# Altium schematic sheet FET_M1.SchDoc
size A
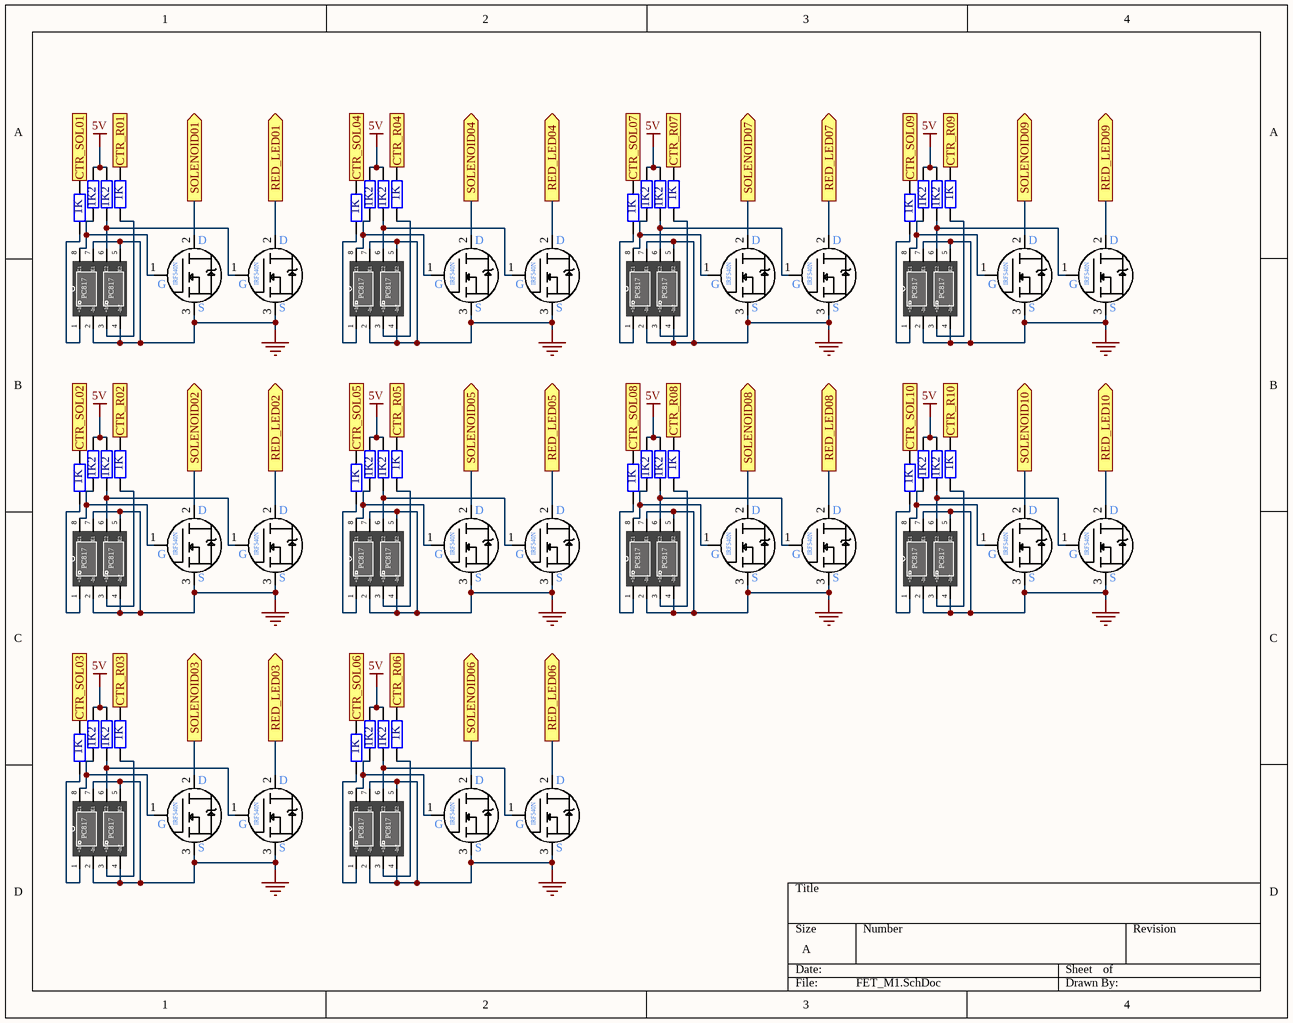
[diagram p0: FET_M1.SchDoc]

## Parts
FET1  5#IRF540N  [5#IRF540N]  (value not drawn)
FET2  5#IRF540N  [5#IRF540N]  (value not drawn)
FET3  5#IRF540N  [5#IRF540N]  (value not drawn)
FET4  5#IRF540N  [5#IRF540N]  (value not drawn)
FET5  5#IRF540N  [5#IRF540N]  (value not drawn)
FET6  5#IRF540N  [5#IRF540N]  (value not drawn)
FET7  5#IRF540N  [5#IRF540N]  (value not drawn)
FET8  5#IRF540N  [5#IRF540N]  (value not drawn)
FET9  5#IRF540N  [5#IRF540N]  (value not drawn)
FET10  5#IRF540N  [5#IRF540N]  (value not drawn)
FET11  5#IRF540N  [5#IRF540N]  (value not drawn)
FET12  5#IRF540N  [5#IRF540N]  (value not drawn)
FET13  5#IRF540N  [5#IRF540N]  (value not drawn)
FET14  5#IRF540N  [5#IRF540N]  (value not drawn)
FET15  5#IRF540N  [5#IRF540N]  (value not drawn)
FET16  5#IRF540N  [5#IRF540N]  (value not drawn)
FET17  5#IRF540N  [5#IRF540N]  (value not drawn)
FET18  5#IRF540N  [5#IRF540N]  (value not drawn)
FET19  5#IRF540N  [5#IRF540N]  (value not drawn)
FET20  5#IRF540N  [5#IRF540N]  (value not drawn)
PC1  5#Dip8_PC817x2  [5#Dip8_PC817x2]  (value not drawn)
PC2  5#Dip8_PC817x2  [5#Dip8_PC817x2]  (value not drawn)
PC3  5#Dip8_PC817x2  [5#Dip8_PC817x2]  (value not drawn)
PC4  5#Dip8_PC817x2  [5#Dip8_PC817x2]  (value not drawn)
PC5  5#Dip8_PC817x2  [5#Dip8_PC817x2]  (value not drawn)
PC6  5#Dip8_PC817x2  [5#Dip8_PC817x2]  (value not drawn)
PC7  5#Dip8_PC817x2  [5#Dip8_PC817x2]  (value not drawn)
PC8  5#Dip8_PC817x2  [5#Dip8_PC817x2]  (value not drawn)
PC9  5#Dip8_PC817x2  [5#Dip8_PC817x2]  (value not drawn)
PC10  5#Dip8_PC817x2  [5#Dip8_PC817x2]  (value not drawn)
R18  1K  [AXIAL-0.4]
R19  1K2  [AXIAL-0.4]
R20  1K  [AXIAL-0.4]
R21  1K2  [AXIAL-0.4]
R22  1K  [AXIAL-0.4]
R23  1K2  [AXIAL-0.4]
R24  1K  [AXIAL-0.4]
R25  1K2  [AXIAL-0.4]
R26  1K  [AXIAL-0.4]
R27  1K2  [AXIAL-0.4]
R28  1K  [AXIAL-0.4]
R29  1K2  [AXIAL-0.4]
R30  1K  [AXIAL-0.4]
R31  1K2  [AXIAL-0.4]
R32  1K  [AXIAL-0.4]
R33  1K2  [AXIAL-0.4]
R34  1K  [AXIAL-0.4]
R35  1K2  [AXIAL-0.4]
R36  1K  [AXIAL-0.4]
R37  1K2  [AXIAL-0.4]
R38  1K  [AXIAL-0.4]
R39  1K2  [AXIAL-0.4]
R40  1K  [AXIAL-0.4]
R41  1K2  [AXIAL-0.4]
R42  1K  [AXIAL-0.4]
R43  1K2  [AXIAL-0.4]
R44  1K  [AXIAL-0.4]
R45  1K2  [AXIAL-0.4]
R46  1K  [AXIAL-0.4]
R47  1K2  [AXIAL-0.4]
R48  1K  [AXIAL-0.4]
R49  1K2  [AXIAL-0.4]
R50  1K  [AXIAL-0.4]
R51  1K2  [AXIAL-0.4]
R52  1K  [AXIAL-0.4]
R53  1K2  [AXIAL-0.4]
R54  1K  [AXIAL-0.4]
R55  1K2  [AXIAL-0.4]
R56  1K  [AXIAL-0.4]
R57  1K2  [AXIAL-0.4]

## Ports
CTR_R01 (in), CTR_R02 (in), CTR_R03 (in), CTR_R04 (in), CTR_R05 (in), CTR_R06 (in), CTR_R07 (in), CTR_R08 (in), CTR_R09 (in), CTR_R10 (in), CTR_SOL01 (in), CTR_SOL02 (in), CTR_SOL03 (in), CTR_SOL04 (in), CTR_SOL05 (in), CTR_SOL06 (in), CTR_SOL07 (in), CTR_SOL08 (in), CTR_SOL09 (in), CTR_SOL10 (in), RED_LED01 (out), RED_LED02 (out), RED_LED03 (out), RED_LED04 (out), RED_LED05 (out), RED_LED06 (out), RED_LED07 (out), RED_LED08 (out), RED_LED09 (out), RED_LED10 (out), SOLENOID01 (out), SOLENOID02 (out), SOLENOID03 (out), SOLENOID04 (out), SOLENOID05 (out), SOLENOID06 (out), SOLENOID07 (out), SOLENOID08 (out), SOLENOID09 (out), SOLENOID10 (out)

## Nets
5V: R19.2 R21.2 R23.2 R25.2 R27.2 R29.2 R31.2 R33.2 R35.2 R37.2 R39.2 R41.2 R43.2 R45.2 R47.2 R49.2 R51.2 R53.2 R55.2 R57.2
GND: FET1.3(S) FET2.3(S) FET3.3(S) FET4.3(S) FET5.3(S) FET6.3(S) FET7.3(S) FET8.3(S) FET9.3(S) FET10.3(S) FET11.3(S) FET12.3(S) FET13.3(S) FET14.3(S) FET15.3(S) FET16.3(S) FET17.3(S) FET18.3(S) FET19.3(S) FET20.3(S) PC1.2(-In1) PC1.4(-In2) PC1.5(E2) PC1.7(E1) PC2.2(-In1) PC2.4(-In2) PC2.5(E2) PC2.7(E1) PC3.2(-In1) PC3.4(-In2) PC3.5(E2) PC3.7(E1) PC4.2(-In1) PC4.4(-In2) PC4.5(E2) PC4.7(E1) PC5.2(-In1) PC5.4(-In2) PC5.5(E2) PC5.7(E1) PC6.2(-In1) PC6.4(-In2) PC6.5(E2) PC6.7(E1) PC7.2(-In1) PC7.4(-In2) PC7.5(E2) PC7.7(E1) PC8.2(-In1) PC8.4(-In2) PC8.5(E2) PC8.7(E1) PC9.2(-In1) PC9.4(-In2) PC9.5(E2) PC9.7(E1) PC10.2(-In1) PC10.4(-In2) PC10.5(E2) PC10.7(E1)
CTR_R01: R26.1 ; port CTR_R01
CTR_R02: R28.1 ; port CTR_R02
CTR_R03: R30.1 ; port CTR_R03
CTR_R04: R32.1 ; port CTR_R04
CTR_R05: R42.1 ; port CTR_R05
CTR_R06: R44.1 ; port CTR_R06
CTR_R07: R46.1 ; port CTR_R07
CTR_R08: R48.1 ; port CTR_R08
CTR_R09: R54.1 ; port CTR_R09
CTR_R10: R56.1 ; port CTR_R10
CTR_SOL01: R18.1 ; port CTR_SOL01
CTR_SOL02: R20.1 ; port CTR_SOL02
CTR_SOL03: R22.1 ; port CTR_SOL03
CTR_SOL04: R24.1 ; port CTR_SOL04
CTR_SOL05: R34.1 ; port CTR_SOL05
CTR_SOL06: R36.1 ; port CTR_SOL06
CTR_SOL07: R38.1 ; port CTR_SOL07
CTR_SOL08: R40.1 ; port CTR_SOL08
CTR_SOL09: R50.1 ; port CTR_SOL09
CTR_SOL10: R52.1 ; port CTR_SOL10
RED_LED01: FET2.2(D) ; port RED_LED01
RED_LED02: FET4.2(D) ; port RED_LED02
RED_LED03: FET6.2(D) ; port RED_LED03
RED_LED04: FET8.2(D) ; port RED_LED04
RED_LED05: FET10.2(D) ; port RED_LED05
RED_LED06: FET12.2(D) ; port RED_LED06
RED_LED07: FET14.2(D) ; port RED_LED07
RED_LED08: FET16.2(D) ; port RED_LED08
RED_LED09: FET18.2(D) ; port RED_LED09
RED_LED10: FET20.2(D) ; port RED_LED10
SOLENOID01: FET1.2(D) ; port SOLENOID01
SOLENOID02: FET3.2(D) ; port SOLENOID02
SOLENOID03: FET5.2(D) ; port SOLENOID03
SOLENOID04: FET7.2(D) ; port SOLENOID04
SOLENOID05: FET9.2(D) ; port SOLENOID05
SOLENOID06: FET11.2(D) ; port SOLENOID06
SOLENOID07: FET13.2(D) ; port SOLENOID07
SOLENOID08: FET15.2(D) ; port SOLENOID08
SOLENOID09: FET17.2(D) ; port SOLENOID09
SOLENOID10: FET19.2(D) ; port SOLENOID10
NetFET1_1: FET1.1(G) PC1.8(C1) R19.1
NetFET2_1: FET2.1(G) PC1.6(C2) R27.1
NetFET3_1: FET3.1(G) PC2.8(C1) R21.1
NetFET4_1: FET4.1(G) PC2.6(C2) R29.1
NetFET5_1: FET5.1(G) PC3.8(C1) R23.1
NetFET6_1: FET6.1(G) PC3.6(C2) R31.1
NetFET7_1: FET7.1(G) PC4.8(C1) R25.1
NetFET8_1: FET8.1(G) PC4.6(C2) R33.1
NetFET9_1: FET9.1(G) PC5.8(C1) R35.1
NetFET10_1: FET10.1(G) PC5.6(C2) R43.1
NetFET11_1: FET11.1(G) PC6.8(C1) R37.1
NetFET12_1: FET12.1(G) PC6.6(C2) R45.1
NetFET13_1: FET13.1(G) PC7.8(C1) R39.1
NetFET14_1: FET14.1(G) PC7.6(C2) R47.1
NetFET15_1: FET15.1(G) PC8.8(C1) R41.1
NetFET16_1: FET16.1(G) PC8.6(C2) R49.1
NetFET17_1: FET17.1(G) PC9.8(C1) R51.1
NetFET18_1: FET18.1(G) PC9.6(C2) R55.1
NetFET19_1: FET19.1(G) PC10.8(C1) R53.1
NetFET20_1: FET20.1(G) PC10.6(C2) R57.1
NetPC1_1: PC1.1(+In1) R18.2
NetPC1_3: PC1.3(+In2) R26.2
NetPC2_1: PC2.1(+In1) R20.2
NetPC2_3: PC2.3(+In2) R28.2
NetPC3_1: PC3.1(+In1) R22.2
NetPC3_3: PC3.3(+In2) R30.2
NetPC4_1: PC4.1(+In1) R24.2
NetPC4_3: PC4.3(+In2) R32.2
NetPC5_1: PC5.1(+In1) R34.2
NetPC5_3: PC5.3(+In2) R42.2
NetPC6_1: PC6.1(+In1) R36.2
NetPC6_3: PC6.3(+In2) R44.2
NetPC7_1: PC7.1(+In1) R38.2
NetPC7_3: PC7.3(+In2) R46.2
NetPC8_1: PC8.1(+In1) R40.2
NetPC8_3: PC8.3(+In2) R48.2
NetPC9_1: PC9.1(+In1) R50.2
NetPC9_3: PC9.3(+In2) R54.2
NetPC10_1: PC10.1(+In1) R52.2
NetPC10_3: PC10.3(+In2) R56.2

## Notes on the sheet
- (in symbol 5#Dip8_PC817x2) PC817
- (in symbol 5#IRF540N) IRF540N

## Library data of the parts
R18-R57 = Res2: Resistor; Published: 8-Jun-2000; LatestRevisionDate: 17-Jul-2002; LatestRevisionNote: Re-released for DXP Platform.; PackageReference: AXIAL-0.4; Publisher: Altium Limited; PackageDescription: Axial Device, Thru-Hole; 2 Leads; 0.4 in Pin Spacing